# Altium schematic sheet I2C-Temp-sensor.SchDoc: =ProjectTitle
size 297 x 209 mm; Address1: Address1; Address2: Address2; Address3: Address3; Address4: Address4; SheetNumber: 10; SheetTotal: 16; Scale: 1:1; DocumentType: Схема электрическая принципиальная
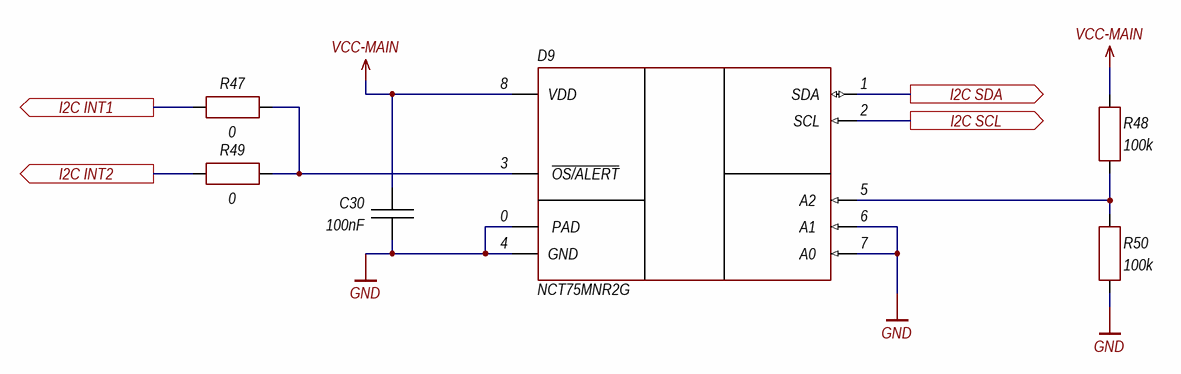
[diagram p0: I2C-Temp-sensor.SchDoc]

## Parts
C30  100nF  [CH0402C]
D9  NCT75MNR2G  [8-DFN (2x2 mm, 0.5mm pitch, EP)]
R47  0  [CH0402R]
R48  100k  [CH0402R]
R49  0  [CH0402R]
R50  100k  [CH0402R]

## Ports
I2C INT1 (out), I2C INT2 (out), I2C SCL (out), I2C SDA (out)

## Nets
GND: C30.1 D9.0(PAD) D9.4(GND) D9.6(A1) D9.7(A0) R50.1
VCC-MAIN: C30.2 D9.8(VDD) R48.2
I2C INT1: R47.1 ; port I2C INT1
I2C INT2: R49.1 ; port I2C INT2
I2C SCL: D9.2(SCL) ; port I2C SCL
I2C SDA: D9.1(SDA) ; port I2C SDA
NetD9_3: D9.3(~{OS/ALERT}) R47.2 R49.2
NetD9_5: D9.5(A2) R48.1 R50.2

## Notes on the sheet
- Изм.
- Лист
- № докум.
- Подп.
- Дата
- Копировал
- Формат А4

## Library data of the parts
C30 = Capacitor: Manufacturer: *; Model: *; HelpURL: *; ComponentKind: *; Value: 100nF
D9 = NCT75MNR2G: Temperature Sensor, I2C; Manufacturer: onsemi; Model: NCT75MNR2G; HelpURL: https://www.lcsc.com/product-detail/Temperature-Sensors_onsemi-NCT75MNR2G_C146741.html; ComponentKind: 3-5.5V, 12b, I2C
R47-R50 = Resistor: Manufacturer: *; Model: *; HelpURL: *; ComponentKind: *
  R47 R49: Value: 0
  R48 R50: Value: 100k